# Altium schematic sheet Humidity Sensor.SchDoc: Nitrogen Generic Sensor
size A4; Author: Michael Kapuscik; Engineer: Michael Kapuscik; SheetNumber: 1
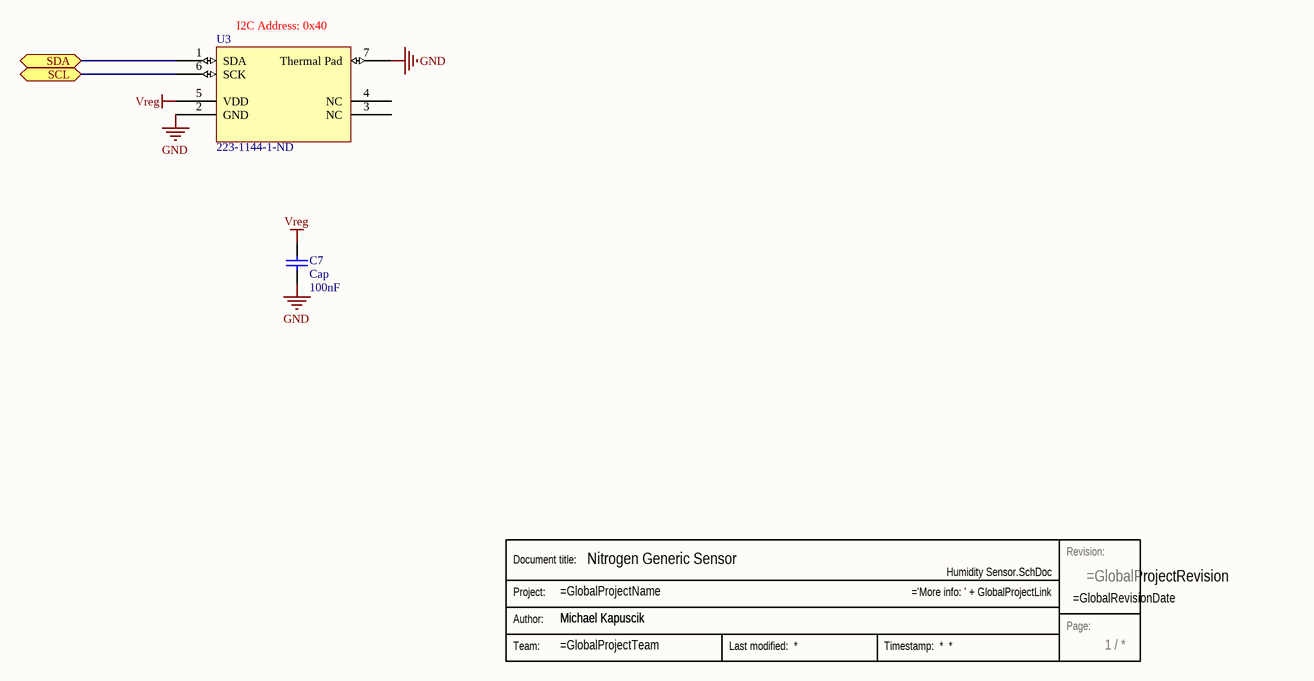
[diagram p0: Humidity Sensor.SchDoc]

## Parts
C7  Cap  value 100nF  [1608[0603]]
Stamp  Stamp  (value not drawn)  (graphical)
U3  Supplier Part Number 1: 223-1144-1-ND  [DFN6 3x3 HTU21D Ambient Measurement]  (hidden comment: I2C Humidity Sensor)

## Ports
SCL (bidir), SDA (bidir)

## Nets
GND: C7.1 U3.2(GND) U3.7(Thermal_Pad)
Vreg: C7.2 U3.5(VDD)
SCL: U3.6(SCK) ; port SCL
SDA: U3.1(SDA) ; port SDA

Not connected (* = marked no-connect by the designer): U3 3(NC) 4(NC)

## Notes on the sheet
- (near U3) I2C Address: 0x40
- (in symbol Stamp) Revision:; Document title:; Project:; Author:; Page:; Team:

## Library data of the parts
C7 = Cap Semi: Capacitor (Semiconductor SIM Model); Published: 8-Jun-2000; LatestRevisionDate: 29-May-2009; LatestRevisionNote: IPC-7351 Footprint Added.; PackageReference: C1206; Publisher: Altium Limited; PackageDescription: Chip Capacitor
U3 = HTU21D-F: Supplier 1: Digi-Key